# Altium schematic sheet Sheet1.SchDoc
size A4
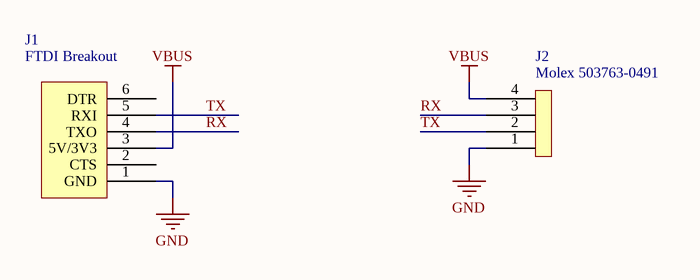
[diagram p0: Sheet1.SchDoc]

## Parts
J1  FTDI Breakout  [FTDI Breakout]
J2  Molex 503763-0491  [Molex 503763-0491]

## Nets
GND: J1.1(GND) J2.1
VBUS: J1.3(5V/3V3) J2.4
RX: J1.4(TXO) J2.3
TX: J1.5(RXI) J2.2

Not connected (* = marked no-connect by the designer): J1 2(CTS) 6(DTR)